# Altium schematic sheet MainPage.SchDoc: =ProjectDescription
size 420 x 297 mm; Address1: Address1; Address2: Address2; Address3: Address3; Address4: Address4; SheetNumber: 1; SheetTotal: 2; Scale: 1:1; DocumentType: Схема электрическая принципиальная
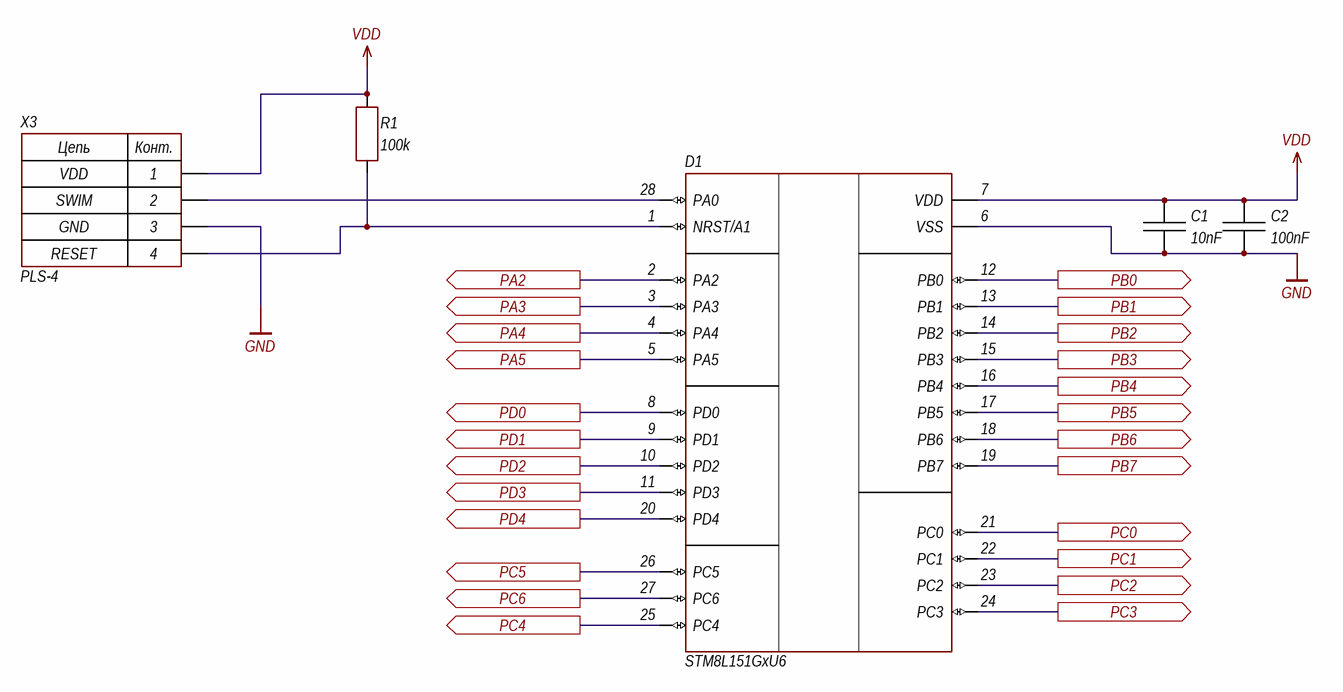
[diagram p0: MainPage.SchDoc]

## Parts
C1  10nF  [CH0402C]
C2  100nF  [CH0402C]
D1  STM8L151GxU6  [28-UFQFPN]
R1  100k  [CH0402R]
X3  PLS-4  [CON: PLS-4]

## Ports
PA2 (out), PA3 (out), PA4 (out), PA5 (out), PB0 (out), PB1 (out), PB2 (out), PB3 (out), PB4 (out), PB5 (out), PB6 (out), PB7 (out), PC0 (out), PC1 (out), PC2 (out), PC3 (out), PC4 (out), PC5 (out), PC6 (out), PD0 (out), PD1 (out), PD2 (out), PD3 (out), PD4 (out)

## Nets
GND: C1.1 C2.1 D1.6(VSS) X3.3
VDD: C1.2 C2.2 D1.7(VDD) R1.2 X3.1
PA2: D1.2(PA2) ; port PA2
PA3: D1.3(PA3) ; port PA3
PA4: D1.4(PA4) ; port PA4
PA5: D1.5(PA5) ; port PA5
PB0: D1.12(PB0) ; port PB0
PB1: D1.13(PB1) ; port PB1
PB2: D1.14(PB2) ; port PB2
PB3: D1.15(PB3) ; port PB3
PB4: D1.16(PB4) ; port PB4
PB5: D1.17(PB5) ; port PB5
PB6: D1.18(PB6) ; port PB6
PB7: D1.19(PB7) ; port PB7
PC0: D1.21(PC0) ; port PC0
PC1: D1.22(PC1) ; port PC1
PC2: D1.23(PC2) ; port PC2
PC3: D1.24(PC3) ; port PC3
PC4: D1.25(PC4) ; port PC4
PC5: D1.26(PC5) ; port PC5
PC6: D1.27(PC6) ; port PC6
PD0: D1.8(PD0) ; port PD0
PD1: D1.9(PD1) ; port PD1
PD2: D1.10(PD2) ; port PD2
PD3: D1.11(PD3) ; port PD3
PD4: D1.20(PD4) ; port PD4
NetD1_1: D1.1(NRST/A1) R1.1 X3.4
NetD1_28: D1.28(PA0) X3.2

## Notes on the sheet
- VDD
- SWIM
- GND
- RESET
- Разраб.
- Изм.
- Лист
- № докум.
- Подп.
- Дата
- Лит.
- Масса
- Масштаб
- Пров.
- Т.контр.
- Листов
- Утв.
- Н.контр.
- 2.106-A3
- Копировал
- Формат А3
- (in symbol 4-Connector) Цепь; Конт.

## Library data of the parts
C1 C2 = Capacitor: Manufacturer: *; Model: *; HelpURL: *; ComponentKind: *
  C1: Value: 10nF
  C2: Value: 100nF
D1 = STM8L151GxU6: STM8; Manufacturer: ST Microelectronics; Model: STM8L151GxU6; ComponentKind: UFQFPN28; HelpURL: https://ru.mouser.com/datasheet/2/389/stm8l151c4-956418.pdf
R1 = Resistor: Manufacturer: *; Model: *; HelpURL: *; ComponentKind: *; Value: 100k
X3 = 4-Connector: Model: PLS-4; Manufacturer: *; HelpURL: *; ComponentKind: *